# Altium schematic sheet Uebersicht.SchDoc: SysP18_Team10: Uebersicht
size A4; Author: Michael Alig; CompanyName: NTB; Organization: NTB Interstate University of Applied; Address1: Werdenbergstrasse 4; Address3: 9471 Buchs; Address4: Switzerland; SheetNumber: 1; SheetTotal: 5; Organization1: Sciences of Technology Buchs; Size: A4; ShortDescription: Uebersicht Leistungselektronik
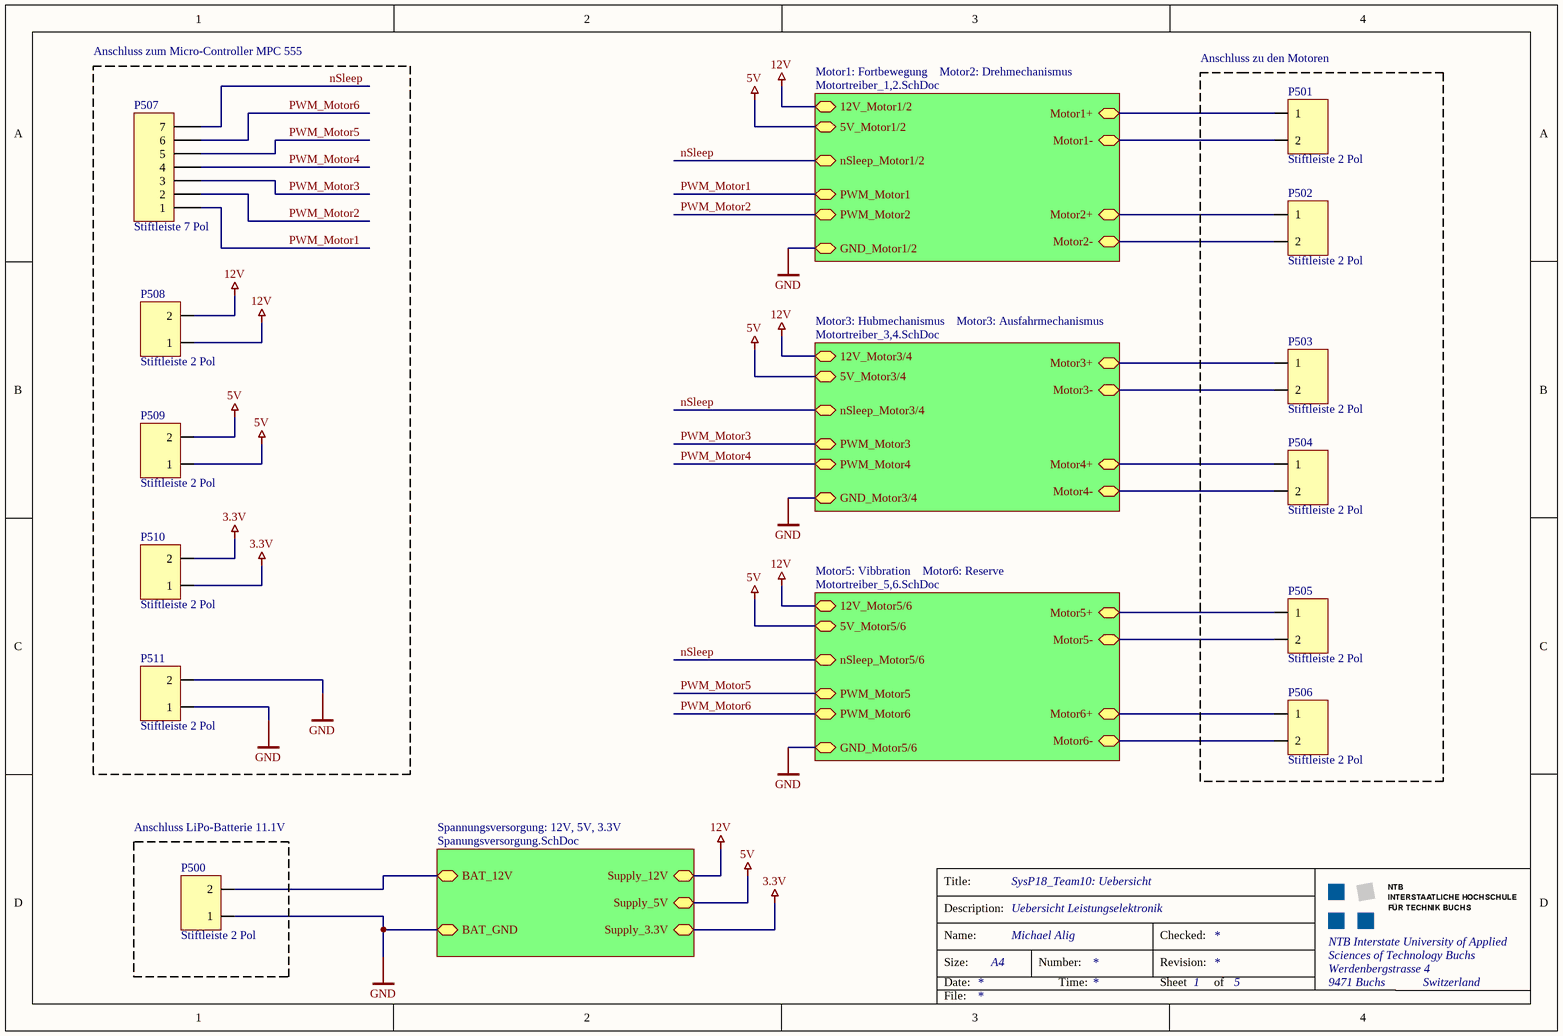
[diagram p0: Uebersicht.SchDoc]

## Parts
P500  Stiftleiste 2 Pol  [2Pin Header 2.54mm]
P501  Stiftleiste 2 Pol  [2Pin Header 2.54mm]
P502  Stiftleiste 2 Pol  [2Pin Header 2.54mm]
P503  Stiftleiste 2 Pol  [2Pin Header 2.54mm]
P504  Stiftleiste 2 Pol  [2Pin Header 2.54mm]
P505  Stiftleiste 2 Pol  [2Pin Header 2.54mm]
P506  Stiftleiste 2 Pol  [2Pin Header 2.54mm]
P507  Stiftleiste 7 Pol  [GEN_HEADER-2.54mm_7_H]
P508  Stiftleiste 2 Pol  [2Pin Header 2.54mm]
P509  Stiftleiste 2 Pol  [2Pin Header 2.54mm]
P510  Stiftleiste 2 Pol  [2Pin Header 2.54mm]
P511  Stiftleiste 2 Pol  [2Pin Header 2.54mm]

## Blocks framed on the sheet
Anschluss zum Micro-Controller MPC 555: P507-P511
Anschluss zu den Motoren: P501-P506
Anschluss LiPo-Batterie 11.1V: P500

## Sub-sheets
Motor1: Fortbewegung    Motor2: Drehmechanismus = Motortreiber_1,2.SchDoc: nSleep_Motor1/2, PWM_Motor2, Motor1+, Motor1-, PWM_Motor1, Motor2+, Motor2-, 12V_Motor1/2, GND_Motor1/2, 5V_Motor1/2
Motor3: Hubmechanismus    Motor3: Ausfahrmechanismus = Motortreiber_3,4.SchDoc: nSleep_Motor3/4, PWM_Motor4, Motor3+, Motor3-, PWM_Motor3, Motor4+, Motor4-, 12V_Motor3/4, GND_Motor3/4, 5V_Motor3/4
Motor5: Vibbration    Motor6: Reserve = Motortreiber_5,6.SchDoc: nSleep_Motor5/6, PWM_Motor6, Motor5+, Motor5-, PWM_Motor5, Motor6+, Motor6-, 12V_Motor5/6, GND_Motor5/6, 5V_Motor5/6
Spannungsversorgung: 12V, 5V, 3.3V = Spanungsversorgung.SchDoc: BAT_12V, BAT_GND, Supply_5V, Supply_3.3V, Supply_12V

## Nets
3.3V: P510.1 P510.2 ; sheet Spannungsversorgung: 12V, 5V, 3.3V/Supply_3.3V
5V: P509.1 P509.2 ; sheet Spannungsversorgung: 12V, 5V, 3.3V/Supply_5V, sheet Motor1: Fortbewegung    Motor2: Drehmechanismus/5V_Motor1/2, sheet Motor3: Hubmechanismus    Motor3: Ausfahrmechanismus/5V_Motor3/4, sheet Motor5: Vibbration    Motor6: Reserve/5V_Motor5/6
12V: P508.1 P508.2 ; sheet Spannungsversorgung: 12V, 5V, 3.3V/Supply_12V, sheet Motor1: Fortbewegung    Motor2: Drehmechanismus/12V_Motor1/2, sheet Motor3: Hubmechanismus    Motor3: Ausfahrmechanismus/12V_Motor3/4, sheet Motor5: Vibbration    Motor6: Reserve/12V_Motor5/6
GND: P500.1 P511.1 P511.2 ; sheet Spannungsversorgung: 12V, 5V, 3.3V/BAT_GND, sheet Motor1: Fortbewegung    Motor2: Drehmechanismus/GND_Motor1/2, sheet Motor3: Hubmechanismus    Motor3: Ausfahrmechanismus/GND_Motor3/4, sheet Motor5: Vibbration    Motor6: Reserve/GND_Motor5/6
nSleep: P507.7 ; sheet Motor1: Fortbewegung    Motor2: Drehmechanismus/nSleep_Motor1/2, sheet Motor3: Hubmechanismus    Motor3: Ausfahrmechanismus/nSleep_Motor3/4, sheet Motor5: Vibbration    Motor6: Reserve/nSleep_Motor5/6
PWM_Motor1: P507.1 ; sheet Motor1: Fortbewegung    Motor2: Drehmechanismus/PWM_Motor1
PWM_Motor2: P507.2 ; sheet Motor1: Fortbewegung    Motor2: Drehmechanismus/PWM_Motor2
PWM_Motor3: P507.3 ; sheet Motor3: Hubmechanismus    Motor3: Ausfahrmechanismus/PWM_Motor3
PWM_Motor4: P507.4 ; sheet Motor3: Hubmechanismus    Motor3: Ausfahrmechanismus/PWM_Motor4
PWM_Motor5: P507.5 ; sheet Motor5: Vibbration    Motor6: Reserve/PWM_Motor5
PWM_Motor6: P507.6 ; sheet Motor5: Vibbration    Motor6: Reserve/PWM_Motor6
NetP500_2: P500.2 ; sheet Spannungsversorgung: 12V, 5V, 3.3V/BAT_12V
NetP501_1: P501.1 ; sheet Motor1: Fortbewegung    Motor2: Drehmechanismus/Motor1+
NetP501_2: P501.2 ; sheet Motor1: Fortbewegung    Motor2: Drehmechanismus/Motor1-
NetP502_1: P502.1 ; sheet Motor1: Fortbewegung    Motor2: Drehmechanismus/Motor2+
NetP502_2: P502.2 ; sheet Motor1: Fortbewegung    Motor2: Drehmechanismus/Motor2-
NetP503_1: P503.1 ; sheet Motor3: Hubmechanismus    Motor3: Ausfahrmechanismus/Motor3+
NetP503_2: P503.2 ; sheet Motor3: Hubmechanismus    Motor3: Ausfahrmechanismus/Motor3-
NetP504_1: P504.1 ; sheet Motor3: Hubmechanismus    Motor3: Ausfahrmechanismus/Motor4+
NetP504_2: P504.2 ; sheet Motor3: Hubmechanismus    Motor3: Ausfahrmechanismus/Motor4-
NetP505_1: P505.1 ; sheet Motor5: Vibbration    Motor6: Reserve/Motor5+
NetP505_2: P505.2 ; sheet Motor5: Vibbration    Motor6: Reserve/Motor5-
NetP506_1: P506.1 ; sheet Motor5: Vibbration    Motor6: Reserve/Motor6+
NetP506_2: P506.2 ; sheet Motor5: Vibbration    Motor6: Reserve/Motor6-

## Notes on the sheet
- Title:
- Description:
- Size:
- Date:
- Name:
- Number:
- Time:
- Revision:
- Sheet
- Checked:
- of
- File:

## Library data of the parts
P500-P506 P508-P511 = 2 Pin Connector: 2 Pin Header 2.54mm
P507 = GEN_HEADER_7: generic Header, 7-Pin; Manufacturer: tbd; #Class: CONNECTOR; Publisher: Altium Limited; #ClassSub: HEADER; ComponentLink1Description: Manufacturer Link; ComponentLink2Description: Datasheet; ComponentLink3Description: Packaging Specification; Distributor: tbd; RefFootprint: GEN_HEADER-2.54mm_7_H; Manufacturer PartNr: tbd; Distributor PartNr: tbd; Published: 20121218; RefFileFOO: *; RefFileSCH: *; RefSchema: GEN_HEADER_7